# EAGLE design apex-alpha-ii-aaa-version (EAGLE 6.3)
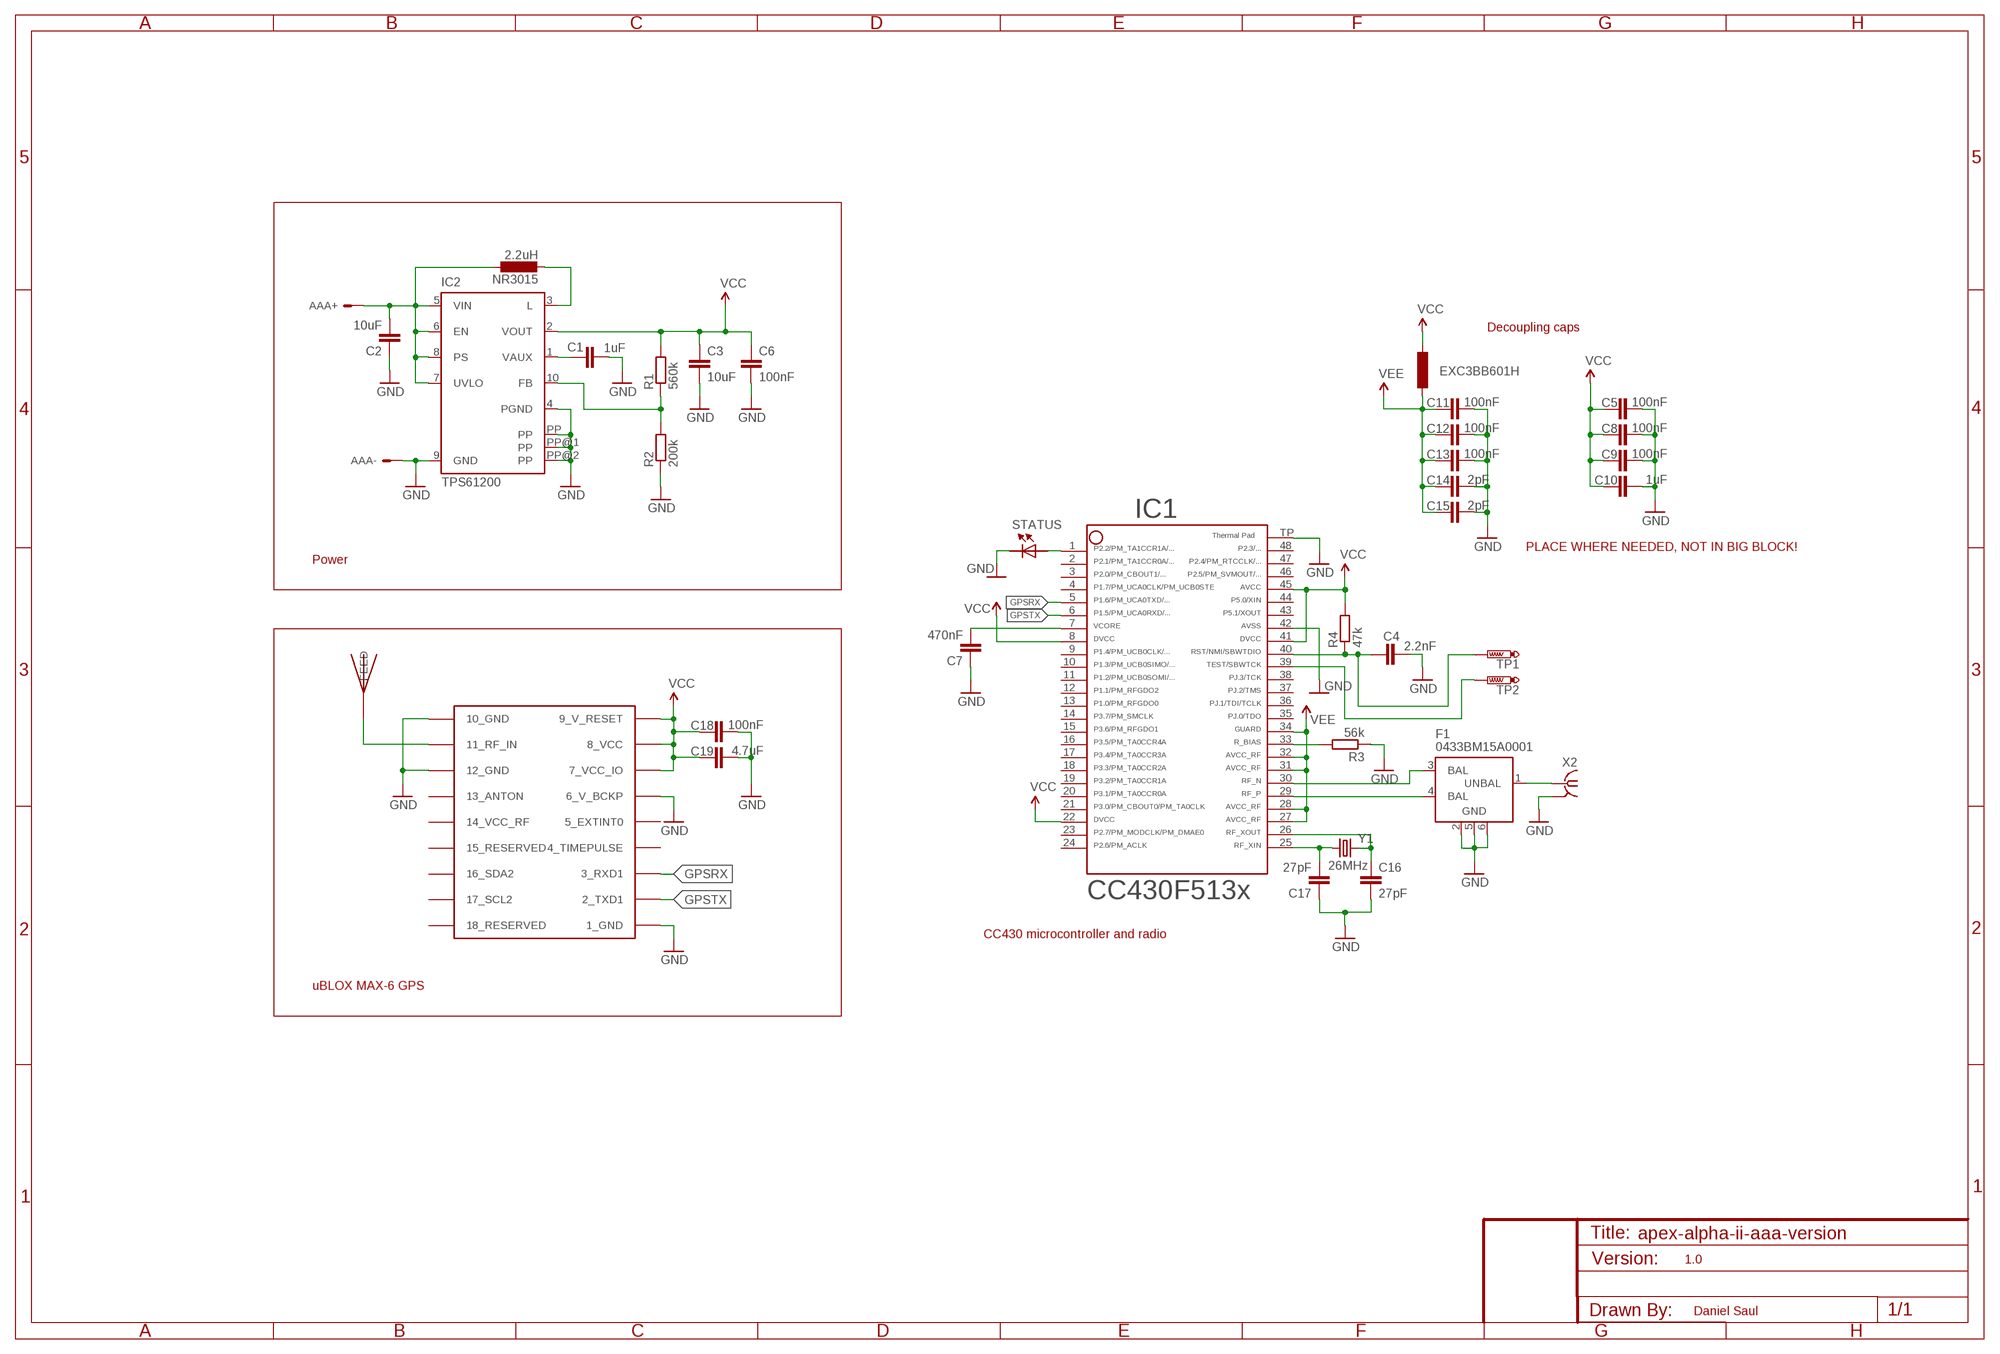
[diagram p0: schematic, sheet 1]

## Parts
AAA  KEYSTONE-2466-THROUGH-HOLE-BATTERY-HOLDER-AAA  [THROUGH-HOLE-BATTERY-HOLDER-AAA]
C1  1uF  CAP0402-CAP  [0402-CAP]
C2  10uF  CAP0805  [0805]
C3  10uF  CAP0805  [0805]
C4  2.2nF  CAP0402-CAP  [0402-CAP]
C5  100nF  CAP0402-CAP  [0402-CAP]
C6  100nF  CAP0402-CAP  [0402-CAP]
C7  470nF  CAP0402-CAP  [0402-CAP]
C8  100nF  CAP0402-CAP  [0402-CAP]
C9  100nF  CAP0402-CAP  [0402-CAP]
C10  1uF  CAP0402-CAP  [0402-CAP]
C11  100nF  CAP0402-CAP  [0402-CAP]
C12  100nF  CAP0402-CAP  [0402-CAP]
C13  100nF  CAP0402-CAP  [0402-CAP]
C14  2pF  CAP0402-CAP  [0402-CAP]
C15  2pF  CAP0402-CAP  [0402-CAP]
C16  27pF  CAP0402-CAP  [0402-CAP]
C17  27pF  CAP0402-CAP  [0402-CAP]
C18  100nF  CAP0402-CAP  [0402-CAP]
C19  4.7uF  CAP0805  [0805]
F1  0433BM15A0001  2450BM15A0002  [2450BM15A0002]
GPS  UBLOX_MAX-6  [UBLOX_MAX-6]
IC1  CC430F5135  CC430F513X---RGZ48  [RGZ48]
IC2  TPS61200  [S-PDSO-N10]
NR3015  2.2uH  NR3015  [NR3015]
R1  560k  R-EU_R0402  [R0402]
R2  200k  R-EU_R0402  [R0402]
R3  56k  R-EU_R0402  [R0402]
R4  47k  R-EU_R0402  [R0402]
TP1  PTR1B1,27  [B1,27]
TP2  PTR1B1,27  [B1,27]
U$1  JTI_ANTENNA-1575AT43A40  [JTI_ANTENNA-1575AT43A40]
U$2  EXC3BB601H  0603INDUCTOR  [R0603]
U$3  STATUS  LED  [R0402]
X2  SMA-142-0701-801/806  [J502-ND-142-0701-801/806]
Y1  26MHz  CRYSTAL5X3  [CRYSTAL-SMD-5X3]

## Nets
GND: AAA.GND C1.2 C2.1 C3.2 C4.2 C5.2 C6.2 C7.1 C8.2 C9.2 C10.2 C11.2 C12.2 C13.2 C14.2 C15.2 C16.2 C17.1 C18.2 C19.2 F1.2(GND) F1.5(GND) F1.6(GND) GPS.1_GND GPS.6_V_BCKP GPS.10_GND GPS.12_GND IC1.42 IC1.TP IC2.4(PGND) IC2.9(GND) IC2.PP IC2.PP@1(PP) IC2.PP@2(PP) R2.1 R3.1 U$3.1(C) X2.G@1(GND)
GPSRX: GPS.3_RXD1 IC1.5
GPSTX: GPS.2_TXD1 IC1.6
N$1: AAA.+V C2.2 IC2.5(VIN) IC2.6(EN) IC2.7(UVLO) IC2.8(PS) NR3015.P$1
N$2: F1.3(BAL) IC1.30
N$3: IC2.3(L) NR3015.P$2
N$4: IC2.10(FB) R1.1 R2.2
N$5: C1.1 IC2.1(VAUX)
N$6: F1.4(BAL) IC1.29
N$7: F1.1(UNBAL) X2.1
N$8: GPS.11_RF_IN U$1.FEED
N$9: IC1.33 R3.2
N$10: C7.2 IC1.7
N$11: C4.1 IC1.40 R4.1 TP1.TP
N$12: IC1.39 TP2.TP
N$13: C17.2 IC1.25 Y1.1
N$14: C16.1 IC1.26 Y1.3
N$15: IC1.1 U$3.2(A)
VCC: C3.1 C5.1 C6.1 C8.1 C9.1 C10.1 C18.1 C19.1 GPS.7_VCC_IO GPS.8_VCC GPS.9_V_RESET IC1.8 IC1.22 IC1.41 IC1.45 IC2.2(VOUT) R1.2 R4.2 U$2.1
VEE: C11.1 C12.1 C13.1 C14.1 C15.1 IC1.27 IC1.28 IC1.31 IC1.32 IC1.34 U$2.2
Unconnected: GPS.4_TIMEPULSE GPS.5_EXTINT0 GPS.13_ANTON GPS.14_VCC_RF GPS.15_RESERVED GPS.16_SDA2 GPS.17_SCL2 GPS.18_RESERVED IC1.2 IC1.3 IC1.4 IC1.9 IC1.10 IC1.11 IC1.12 IC1.13 IC1.14 IC1.15 IC1.16 IC1.17 IC1.18 IC1.19 IC1.20 IC1.21 IC1.23 IC1.24 IC1.35 IC1.36 IC1.37 IC1.38 IC1.43 IC1.44 IC1.46 IC1.47 IC1.48

## Notes on the sheet
- Decoupling caps
- PLACE WHERE NEEDED, NOT IN BIG BLOCK!
- Power
- CC430 microcontroller and radio
- uBLOX MAX-6 GPS
- 1.0
- Daniel Saul

## Power pins joined to a net without a drawn wire
GND: X2.G@2(GND) X2.G@3(GND) X2.G@4(GND)

## Library data of the parts
AAA = apex:KEYSTONE-2466-THROUGH-HOLE-BATTERY-HOLDER-AAA
C1-C19 = apex:CAP: Capacitor Standard 0603 ceramic capacitor, and 0.1" leaded capacitor.
F1 = johanson-technology:2450BM15A0002: 2.45 GHz Impedance Matched Balun-Filter For TI CC253X/CC2540 Chipset family Data sheet <http://www.johansontechnology.com/images/stories/ip/baluns/balun_filter_combo_matched_2450bm15a0002_v8.pdf>
GPS = Ava:UBLOX_MAX-6: UBLOX MAX-6
IC1 = TI_MSP430_v16:CC430F513X---RGZ48: ***CC430F513X***RGZ48 ** ** Rev 1.0 ** 06/2010 * http://focus.ti.com/docs/prod/folders/print/cc430f5137.html
IC2 = texas:TPS6120*: LOW INPUT VOLTAGE SYNCHRONOUS BOOST CONVERTER WITH 1.3-A SWITCHES Source: http://focus.ti.com/lit/ds/symlink/tps61200.pdf; MPN: TPS61200DRCT; OC_FARNELL: 1471238; OC_NEWARK: 37M0066
NR3015 = apex:NR3015
R1-R4 = apex:R-EU_: RESISTOR, European symbol
TP1 TP2 = testpad:PTR1: TEST PIN
U$1 = Ava:JTI_ANTENNA-1575AT43A40
U$2 = apex:0603INDUCTOR
U$3 = apex:LED: SMD LED
X2 = !danielparts:SMA-: SMA 50 Ohm End Launch Jack Receptacle - Round Contact Johnson Components Source: www.johnsoncomponents.com .. J502-ND.pdf; MF: JOHNSON COMPONENTS; MPN: 142-0701-801; OC_FARNELL: 1608592; OC_NEWARK: 90F2624
Y1 = SparkFun:CRYSTAL: Crystals Various standard crystals. Proven footprints. Spark Fun Electronics SKU : COM-00534

## Board
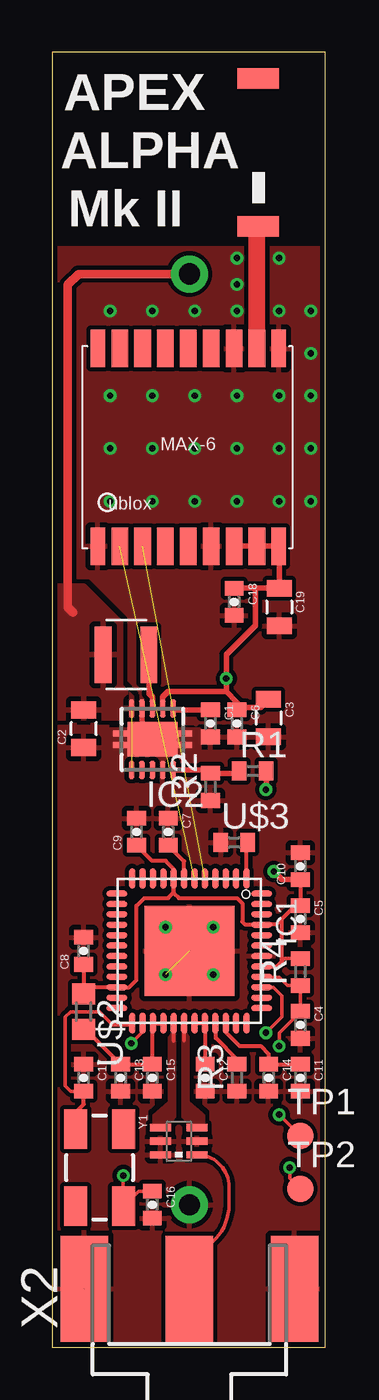
[diagram p1: board, top side]
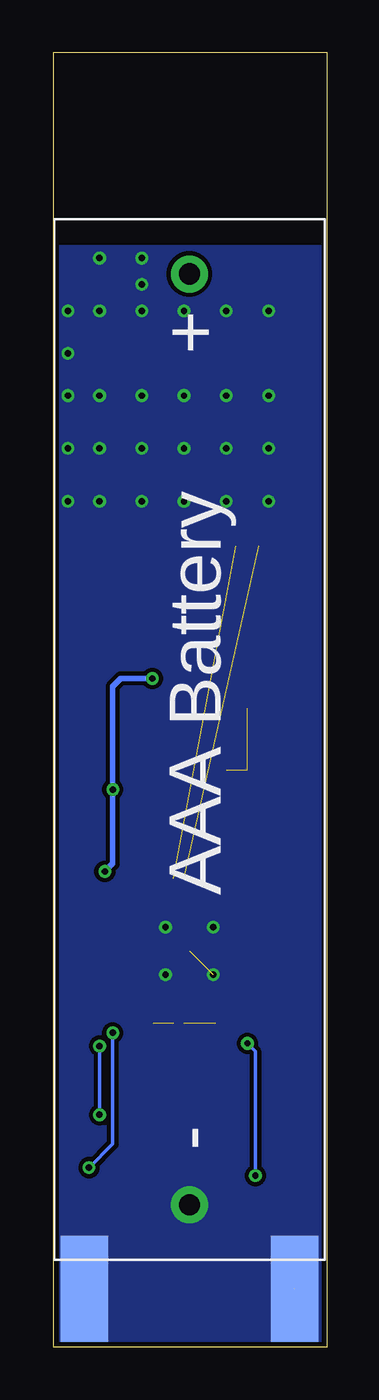
[diagram p2: board, bottom side, seen from below]

Size 13.13 x 62.22 mm. Coordinates in mm from the lower left corner, seen from the top.
Outline: 0,0 13.13,0 13.13,62.22 0,62.22 0,0
Copper layers (1*16): Top 0.035mm / dielectric 1.5mm / Bottom 0.035mm
Design rules "default *": minimum track width 6mil, minimum drill 12mil, track to track 8mil, track to pad 6mil, pad to pad 6mil, via to via 6mil, smd to smd 0mil, copper to edge 10mil, drill to drill 10mil, minimum pad ring 10mil, minimum via ring 6mil, stop-mask expansion 2mil, vias tented up to drill 100mil, thermal gap 10mil

### Footprints (pad centres in the part's own frame; a part is rotated, then mirrored left to right if it is on the bottom)
THROUGH-HOLE-BATTERY-HOLDER-AAA = drill 1.016 pad 1.778: +V -22.352,0; GND 22.352,0
0402-CAP = smd 0.7 x 0.9: 1 -0.65,0; 2 0.65,0
0805 = smd 0.8 x 1.2: 1 -0.9,0; 2 0.9,0
2450BM15A0002 = smd 0.35 x 1: 1 -0.65,-0.875; 2 0,-0.875; 3 0.65,-0.875; 4 0.65,0.875; 5 0,0.875; 6 -0.65,0.875
UBLOX_MAX-6 = smd 1.8 x 0.7: 1_GND 4.95,-4.4; 9_V_RESET 4.95,4.3; 10_GND -4.55,4.3; 18_RESERVED -4.55,-4.4 | smd 1.8 x 0.8: 2_TXD1 4.95,-3.35; 3_RXD1 4.95,-2.25; 4_TIMEPULSE 4.95,-1.15; 5_EXTINT0 4.95,-0.05; 6_V_BCKP 4.95,1.05; 7_VCC_IO 4.95,2.15; 8_VCC 4.95,3.25; 11_RF_IN -4.55,3.25; 12_GND -4.55,2.15; 13_ANTON -4.55,1.05; 14_VCC_RF -4.55,-0.05; 15_RESERVED -4.55,-1.15; 16_SDA2 -4.55,-2.25; 17_SCL2 -4.55,-3.35
RGZ48 = smd 1.016 x 0.3: 1 -3.477,2.75; 2 -3.477,2.25; 3 -3.477,1.75; 4 -3.477,1.25; 5 -3.477,0.75; 6 -3.477,0.25; 7 -3.477,-0.25; 8 -3.477,-0.75; 9 -3.477,-1.25; 10 -3.477,-1.75; 11 -3.477,-2.25; 12 -3.477,-2.75; 25 3.477,-2.75; 26 3.477,-2.25; 27 3.477,-1.75; 28 3.477,-1.25; 29 3.477,-0.75; 30 3.477,-0.25; 31 3.477,0.25; 32 3.477,0.75; 33 3.477,1.25; 34 3.477,1.75; 35 3.477,2.25; 36 3.477,2.75 | smd 0.3 x 1.016: 13 -2.75,-3.477; 14 -2.25,-3.477; 15 -1.75,-3.477; 16 -1.25,-3.477; 17 -0.75,-3.477; 18 -0.25,-3.477; 19 0.25,-3.477; 20 0.75,-3.477; 21 1.25,-3.477; 22 1.75,-3.477; 23 2.25,-3.477; 24 2.75,-3.477; 37 2.75,3.477; 38 2.25,3.477; 39 1.75,3.477; 40 1.25,3.477; 41 0.75,3.477; 42 0.25,3.477; 43 -0.25,3.477; 44 -0.75,3.477; 45 -1.25,3.477; 46 -1.75,3.477; 47 -2.25,3.477; 48 -2.75,3.477 | smd 4.318 x 4.318: TP 0,0
S-PDSO-N10 = smd 0.28 x 0.85: 1 -1,-1.475; 2 -0.5,-1.475; 3 0,-1.475; 4 0.5,-1.475; 5 1,-1.475; 6 1,1.475; 7 0.5,1.475; 8 0,1.475; 9 -0.5,1.475; 10 -1,1.475 | smd 2.4 x 1.65: PP 0,0 | smd 3.8 x 0.28: PP@1 0,0.275; PP@2 0,-0.275
NR3015 = smd 0.8 x 2.7: P$1 1.1,0; P$2 -1.1,0
R0402 = smd 0.7 x 0.9: 1 -0.65,0; 2 0.65,0
B1,27 = smd 1.27 x 1.27: TP 0,0
JTI_ANTENNA-1575AT43A40 = smd 1 x 2: FEED -3.81,-1.27; NC 3.29,-1.27
R0603 = smd 1 x 1.1: 1 -0.85,0; 2 0.85,0
J502-ND-142-0701-801/806 = smd 5.08 x 2.286: 1 2.565,0; G@1 2.565,5.055; G@2 2.565,-5.055 | smd 5.08 x 2.286 bottom: G@3 2.565,5.055; G@4 2.565,-5.055
CRYSTAL-SMD-5X3 = smd 1.9 x 1.1: 1 -1.85,-1.15; 2 1.85,-1.15; 3 1.85,1.15; 4 -1.85,1.15

### Placement (x,y rotation side)
AAA  6.6,29.21 270 bottom
C1  7.62,29.97 270 top
C2  1.52,29.72 90 top
C3  10.41,30.23 270 top
C4  11.94,15.49 270 top
C5  11.94,20.57 270 top
C6  8.89,29.97 270 top
C7  5.59,24.77 270 top
C8  1.52,19.05 90 top
C9  4.06,24.77 90 top
C10  11.94,23.11 90 top
C11  11.94,12.95 270 top
C12  7.37,12.95 270 top
C13  3.3,12.95 270 top
C14  10.41,12.95 270 top
C15  4.83,12.95 270 top
C16  4.83,6.86 270 top
C17  1.52,12.95 270 top
C18  8.76,35.81 270 top
C19  10.92,35.56 270 top
F1  6.1,9.91 90 top
GPS  6.6,43.43 270 top
IC1  6.6,19.05 270 top
IC2  4.83,29.21 180 top
NR3015  3.56,33.27 180 top
R1  9.65,27.69 0 top
R2  7.62,26.92 90 top
R3  8.89,12.95 90 top
R4  11.94,18.03 90 top
TP1  11.94,10.16 0 top
TP2  11.94,7.62 0 top
U$1  8.64,57.66 90 top
U$2  1.52,16.13 270 top
U$3  8.76,24.26 0 top
X2  6.6,0.25 90 top
Y1  2.29,8.64 270 top

### Tracks (layer width: path | path; a pad name or v marks a point on that pad's centre or on a via)
GND  (via drill 0.3 pad 0.41)  (2 unrouted)
  Top 0.254: IC2.4 4.33,29.98 IC2.PP@2
  other vias: 2.79,49.78 4.83,49.78 6.86,49.78 8.89,49.78 10.92,49.78 2.79,45.72 4.83,45.72 6.86,45.72 8.89,45.72 10.92,45.72 12.45,49.78 12.45,45.72 12.45,47.75 2.79,43.18 4.83,43.18 6.86,43.18 8.89,43.18 10.92,43.18 12.45,43.18 2.79,40.64 4.83,40.64 6.86,40.64 8.89,40.64 10.92,40.64 12.45,40.64 8.89,51.05 8.89,52.32 10.92,52.32 5.46,20.19 7.75,20.19 7.75,17.91 5.46,17.91
  pour Bottom (no thermals): -0.25,52.83 13.72,52.83 13.72,-0.51 0,-0.51 -0.25,-0.76
  pour Top (isolate 0.203, rank 3): 0,52.83 13.21,52.83 13.21,-0.51 0,-0.51 -0.25,-0.76
  pour Top (isolate 0.178, no thermals): 2.54,29.72 7.11,29.72 7.11,28.19 2.54,28.19
GPSRX  (1 unrouted)
GPSTX  (1 unrouted)
N$1  (3 unrouted)
  Top 0.406: AAA.+V 1.27,51.56 0.76,51.05 0.76,35.56 1.02,35.31
  pour Top (isolate 0.178): 0.25,36.58 1.52,36.58 3.3,34.8 3.3,31.75 4.06,30.99 4.06,30.23 0.25,30.23
N$2
  Top 0.178: IC1.30 6.35,14.74 6.35,14.73
  pour Top (isolate 0.178, no thermals): 6.48,15.24 6.6,15.11 6.6,11.81 7.24,11.3 7.37,11.18 7.37,10.67 6.48,10.67 6.48,10.79 6.22,11.05 6.22,15.24
N$3
  Top 0.254: NR3015.P$2 4.66,31.41 4.83,31.24 IC2.3
N$4
  Top 0.254: IC2.10 7.46,27.73 R2.2 8.89,27.57 R1.1
N$5
  Top 0.254: C1.1 5.89,30.62 IC2.1
N$6
  Top 0.178: IC1.29 5.85,14.74 5.84,14.73
  pour Top (isolate 0.178, no thermals): 5.59,15.11 5.59,11.81 4.83,11.18 4.83,10.67 5.71,10.67 5.71,10.79 5.97,11.05 5.97,15.37 5.84,15.37
N$7
  Top 0: 6.1,4.45 5.46,4.45 arc-90 6.6,3.3 X2.1
  Top 0.178: F1.1 arc-90 8.51,7.72 8.51,6.86 arc-90 6.1,4.45
N$8
  Top 0.254: 9.85,53.8 U$1.FEED
  Top 0.813: GPS.11_RF_IN 9.85,53.8
N$9
  Top 0.203: R3.2 8.89,13.84 7.87,14.86 7.87,15.55 IC1.33
N$10
  Top 0.203: IC1.7 6.35,23.35 C7.2
N$11  (via drill 0.3 pad 0.41)
  Top 0.178: IC1.40 10.1,17.78 10.92,17.78 11.32,17.38 R4.1 C4.1 10.92,15.11 v10.92,14.48 | v10.92,11.18 TP1.TP
  Bottom 0.178: v10.92,14.48 v10.92,11.18
N$12  (via drill 0.3 pad 0.41)
  Top 0.178: IC1.39 10.64,17.3 11.05,16.89 11.05,15.88 v10.29,15.11 | v11.43,8.64 11.43,8.13 TP2.TP
  Bottom 0.178: v10.29,15.11 10.29,9.78 v11.43,8.64
N$13
  Top 0.178: C17.2 0.9,12.3 0.64,12.57 0.64,15.88 0.89,16.13 2.29,16.13 2.92,15.49 3.77,15.49 IC1.25 | Y1.1 1.14,11.3
  Top 0.203: 1.14,11.3 1.52,11.68 C17.2
N$14  (via drill 0.3 pad 0.41)
  Top 0.178: IC1.26 4.35,15.15 v3.81,14.61 | C16.1 4.16,7.51 Y1.3 3.43,6.79 v3.43,8.26
  Bottom 0.178: v3.81,14.61 3.43,14.22 v3.43,8.26
N$15
  Top 0.203: IC1.1 9.35,24.2 U$3.2
VCC  (via drill 0.3 pad 0.41)
  Top 0.178: R4.2 11.19,18.68 11.05,18.54
  Top 0.203: IC1.8 5.85,22.98 5.46,23.37 4.81,23.37 C9.1 | C10.1 C5.1 11.7,21.22 11.05,20.57 | 11.05,20.57 10.79,20.32 10.1,20.32 IC1.45 10.06,20.32 9.27,20.32 9.14,20.45 9.14,21.34 8.89,21.59 6.1,21.59 5.85,21.83 IC1.8 | IC1.41 10.81,18.3 11.05,18.54 11.05,20.57 | C8.1 U$2.1 1.84,17.3 IC1.22 3.71,17.3 4.06,17.65 4.06,21.21 4.45,21.59 5.59,21.59 5.84,21.84 5.84,22.52 IC1.8
  Top 0.254: C18.1 9.78,36.46 | 9.78,36.46 C19.1 10.92,38.47 GPS.9_V_RESET GPS.8_VCC GPS.7_VCC_IO | IC2.2 5.33,31.23 5.59,31.5 8.38,31.5 | C6.1 8.89,30.73 | 8.38,31.5 8.89,30.99 8.89,30.73 | 8.89,30.73 10.02,30.73 C3.1 | R1.2 10.3,26.81 v10.29,26.8 | v10.67,22.86 11.05,22.48 11.92,22.48 C10.1 | 8.38,31.5 v8.38,32.13 8.38,33.27 9.78,34.67 9.78,36.46
  Bottom 0.254: v10.67,22.86 10.29,23.24 v10.29,26.8 10.29,31.75 9.91,32.13 v8.38,32.13
VEE  (2 unrouted)
  Top 0.203: U$2.2 1.63,15.28 C13.1 C15.1 4.83,15.54 IC1.27 IC1.28 | IC1.31 IC1.32 7.35,13.62 C12.1 | IC1.34 8.35,15.14 9.02,14.48 10.03,14.48 10.41,14.1 C14.1 C11.1

### Text on the board
tPlace: APEX | ALPHA | Mk II